# Altium schematic sheet Tonegenerator.SchDoc: Tonegenerator
size A4; DrawnBy: Knut Aldrin Wikström; Engineer: Knut Aldrin Wikström; Organization: Omega Verksted; Revision: 0.1; DocumentName: Tonegenerator; ProjectName: Teslacom 2014
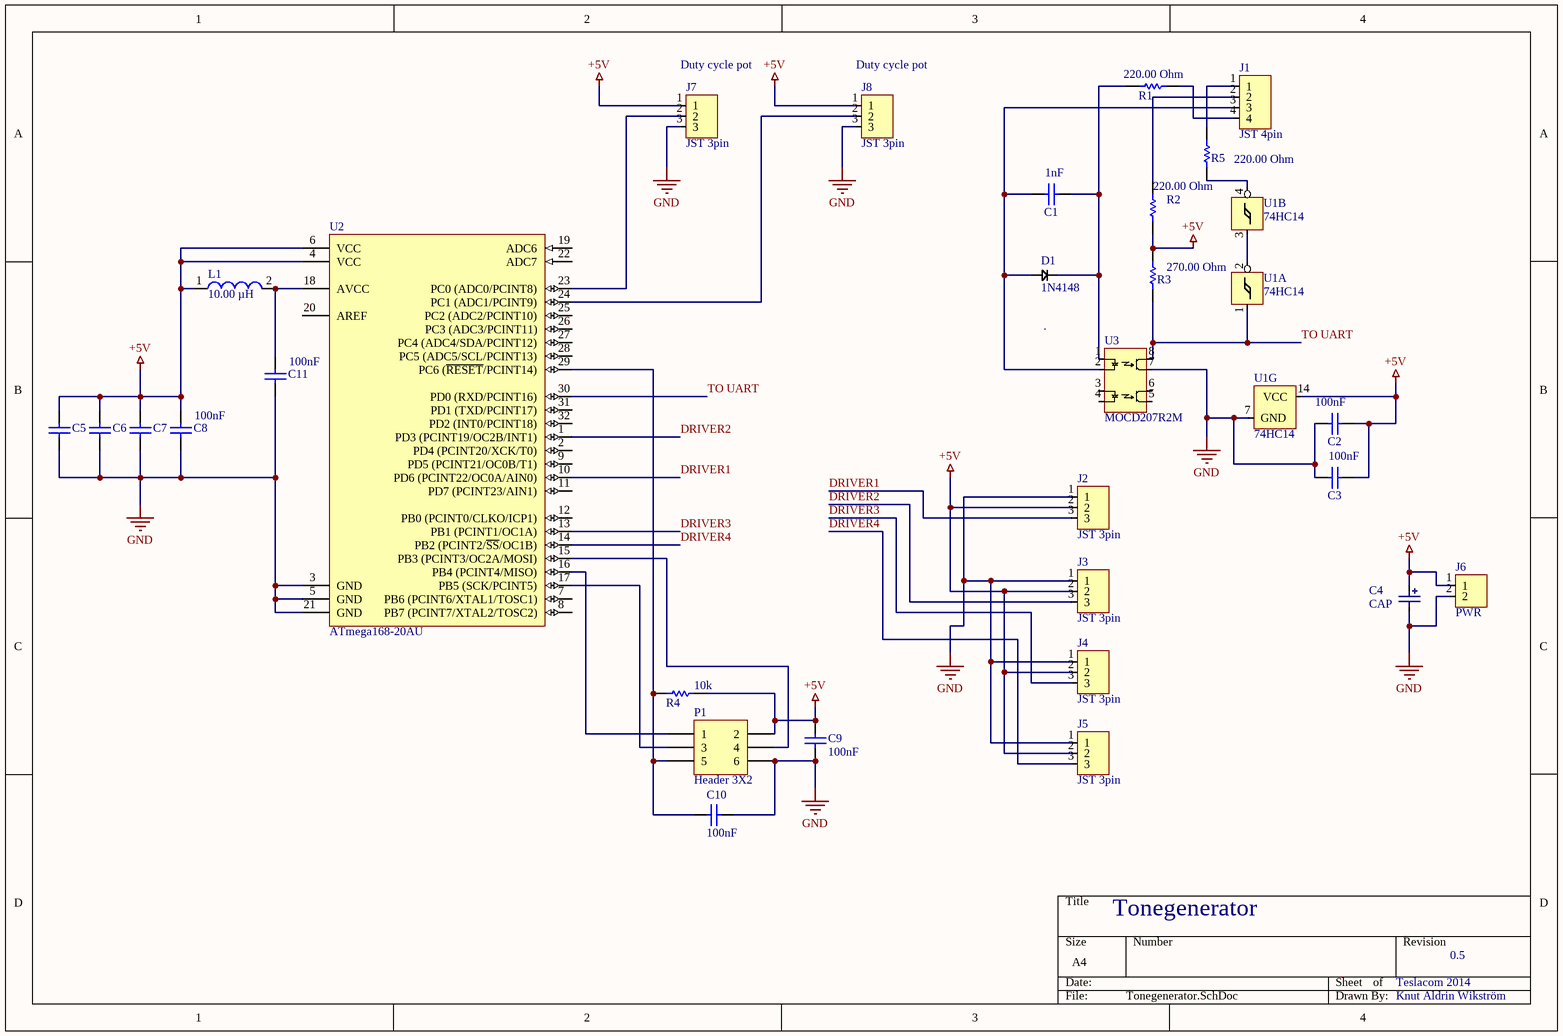
[diagram p0: Tonegenerator.SchDoc]

## Parts
C1  value 1nF  [CAPC0805(2012)100_L]  (hidden comment: CAP 1nF 50V 0805(2012))
C2  value 100nF  [CAPC0805(2012)100_L]  (hidden comment: CAP 100nF 50V 0805(2012))
C3  value 100nF  [CAPC0805(2012)100_L]  (hidden comment: CAP 100nF 50V 0805(2012))
C4  CAP  [CAP 2.5mm]
C5  CAP 100nF 50V 0805(2012)  [CAPC0805(2012)100_L]  (value not drawn)
C6  CAP 100nF 50V 0805(2012)  [CAPC0805(2012)100_L]  (value not drawn)
C7  CAP 100nF 50V 0805(2012)  [CAPC0805(2012)100_L]  (value not drawn)
C8  value 100nF  [CAPC0805(2012)100_L]  (hidden comment: CAP 100nF 50V 0805(2012))
C9  100nF  [CAPC0805(2012)100_L]
C10  100nF  [CAPC0805(2012)100_L]
C11  value 100nF  [CAPC0805(2012)100_L]  (hidden comment: CAP 100nF 50V 0805(2012))
D1  1N4148  [1N4148]
J1  JST 4pin  [JST 4pin]
J2  JST 3pin  [JST 3pin]
J3  JST 3pin  [JST 3pin]
J4  JST 3pin  [JST 3pin]
J5  JST 3pin  [JST 3pin]
J6  PWR  [JST 2pin]
J7  JST 3pin  [JST 3pin]
J8  JST 3pin  [JST 3pin]
L1  Inductance: 10.00 µH  [SMD-1210]  (hidden comment: 7447918)
P1  Header 3X2  [HDR2X3]
R1  value 220.00 Ohm  [RESC0805(2012)_L]  (hidden comment: 220R 5% 0805(2012))
R2  value 220.00 Ohm  [RESC0805(2012)_L]  (hidden comment: 220R 5% 0805(2012))
R3  value 270.00 Ohm  [RESC0805(2012)_N]  (hidden comment: 270R 5% 0805(2012))
R4  Readable value: 10k  [RESC0805(2012)_M]  (hidden comment: 10K 1% 0805(2012))
R5  value 220.00 Ohm  [RESC0805(2012)_L]  (hidden comment: 220R 5% 0805(2012))
U1  74HC14  [SOP14]  (parts A,B,G of 7)
U2  ATmega168-20AU  [32A_N]
U3  MOCD207R2M  [SOP8]

## Nets
+5V: C2.2 C3.2 C4.2 C5.2 C6.2 C7.2 C8.2 C9.2 J2.2 J3.2 J4.2 J5.2 J6.1 J7.1 J8.1 L1.1 P1.2 R2.1 R3.2 R4.2 U1.14(VCC) U2.4(VCC) U2.6(VCC)
GND: C2.1 C3.1 C4.1 C5.1 C6.1 C7.1 C8.1 C9.1 C10.1 C11.1 J2.1 J3.1 J4.1 J5.1 J6.2 J7.3 J8.3 P1.6 U1.7(GND) U2.3(GND) U2.5(GND) U2.21(GND) U3.7
DRIVER1: J2.3 U2.10(PD6_(PCINT22/OC0A/AIN0))
DRIVER2: J3.3 U2.1(PD3_(PCINT19/OC2B/INT1))
DRIVER3: J4.3 U2.13(PB1_(PCINT1/OC1A))
DRIVER4: J5.3 U2.14(PB2_(PCINT2/~{SS}/OC1B))
TO UART: R3.1 U1.1 U2.30(PD0_(RXD/PCINT16)) U3.8
NetC1_1: C1.1 D1.A J1.3 U3.2
NetC1_2: C1.2 D1.K R1.1 U3.1
NetC10_2: C10.2 P1.5 R4.1 U2.29(PC6_(~{RESET}/PCINT14))
NetC11_2: C11.2 L1.2 U2.18(AVCC)
NetJ1_1: J1.1 R5.2
NetJ1_2: J1.2 R2.2
NetJ1_4: J1.4 R1.2
NetJ7_2: J7.2 U2.23(PC0_(ADC0/PCINT8))
NetJ8_2: J8.2 U2.24(PC1_(ADC1/PCINT9))
NetP1_1: P1.1 U2.16(PB4_(PCINT4/MISO))
NetP1_3: P1.3 U2.17(PB5_(SCK/PCINT5))
NetP1_4: P1.4 U2.15(PB3_(PCINT3/OC2A/MOSI))
NetR5_1: R5.1 U1.4
NetU1_2: U1.2 U1.3

Not connected (* = marked no-connect by the designer): U2 2(PD4_(PCINT20/XCK/T0)) 7(PB6_(PCINT6/XTAL1/TOSC1)) 8(PB7_(PCINT7/XTAL2/TOSC2)) 9(PD5_(PCINT21/OC0B/T1)) 11(PD7_(PCINT23/AIN1)) 12(PB0_(PCINT0/CLKO/ICP1)) 19(ADC6) 20(AREF) 22(ADC7) 25(PC2_(ADC2/PCINT10)) 26(PC3_(ADC3/PCINT11)) 27(PC4_(ADC4/SDA/PCINT12)) 28(PC5_(ADC5/SCL/PCINT13)) 31(PD1_(TXD/PCINT17)) 32(PD2_(INT0/PCINT18)); U3 3 4 5 6

## Notes on the sheet
- (near J7) Duty cycle pot
- (near J8) Duty cycle pot
- Tonegenerator
- Teslacom 2014
- 0.5
- Knut Aldrin Wikström

## Library data of the parts
C1 = CMP-1036-02977-1: CAP 1nF 50V ±5% 0805 (2012 Metric) Thickness 1mm SMD; Case-Metric: 2012; Case-EIA: 0805; Max Thickness: 1 mm; Rated Voltage: 50 V; Tolerance: ±5%; Technology: SMT
C2 C3 C5-C11 = CMP-1036-04418-1: CAP 100nF 50V ±5% 0805 (2012 Metric) Thickness 1mm SMD; Case-EIA: 0805; Case-Metric: 2012; Tolerance: ±5%; Max Thickness: 1 mm; Technology: SMT; Rated Voltage: 50 V
  C5-C7 C9 C10: Value: 100nF
J6 = JST 2pin
L1 = CMP-0221-00030-1: SMD-Multilayer Inductor WE-MI, L = 10.00 µH; ComponentLink2URL: http://www.we-online.de/katalog/media/pdf/7447918.pdf; ComponentLink1Description: Manufacturer Link; PackageVersion: 2007; DatasheetVersion: ver 5, Oct-2004; PackageReference: SMD-1210; ComponentLink1URL: http://www.we-online.com; PackageDescription: Chip Inductor, 2-Leads, Body 3.2 x 2.5 mm; ComponentLink2Description: Datasheet
P1 = Header 3X2: Header, 3-Pin, Dual row; LatestRevisionDate: 17-Jul-2002; LatestRevisionNote: Re-released for DXP Platform.; Publisher: Altium Limited
R1 R2 R5 = CMP-1013-00058-1: 220R 0.125W 5% 0805 (2012 Metric)  SMD; Case-Metric: 2012; Case-EIA: 0805; Technology: SMT; Power: 0.125 W; Tolerance: 5 %
R3 = CMP-1013-00060-1: 270R 0.125W 5% 0805 (2012 Metric)  SMD; Case-Metric: 2012; Case-EIA: 0805; Power: 0.125 W; Technology: SMT; Tolerance: 5 %
R4 = CMP-1013-00623-1: 10K 0.125W 1% 0805 (2012 Metric)  SMD; Value: 10000.00 Ohm; Case-Metric: 2012; Case-EIA: 0805; Tolerance: 1 %; Power: 0.125 W; Technology: SMT
U2 = CMP-0095-00552-1: 8-bit AVR Microcontroller, 2.7-5.5V, 20MHz, 16KB Flash, 512 Bytes EEPROM, 1KB SRAM, 32-pin TQFP, Industrial Grade (-40°C to 85°C); Code_JEDEC: MS-026-ABA; ComponentLink2URL: http://www.atmel.com/dyn/resources/prod_documents/doc2545.pdf; ComponentLink1Description: Manufacturer URL; PackageVersion: revC, Oct-2010; ComponentLink2Description: ATmega48/88/168 Datasheet; ComponentLink3URL: http://www.atmel.com/dyn/resources/prod_documents/2545S.pdf; PackageReference: 32A; ComponentLink3Description: ATmega48/88/168 Summary; DatasheetVersion: revT, May-2011; PackageDescription: 32-Lead, 7x7x1.0 mm Body, 0.8mm Lead Pitch, Thin Profile Plastic Quad Flat Package (TQFP); ComponentLink1URL: http://www.atmel.com/